# EasyEDA Pro project ProPrj_Piano_scan_for_conserts3_2026-02-26.epro, schematic reuse_sensors
Board Name: reuse_sensors; Create Date: 2025-11-23; Page Name: rs; Project Name: Piano_scan_for_conserts; Schematic Name: reuse_sensors; Update Date: 2025-11-23; Company: EasyEDA.com; Page Size: A4; Version: V1.0
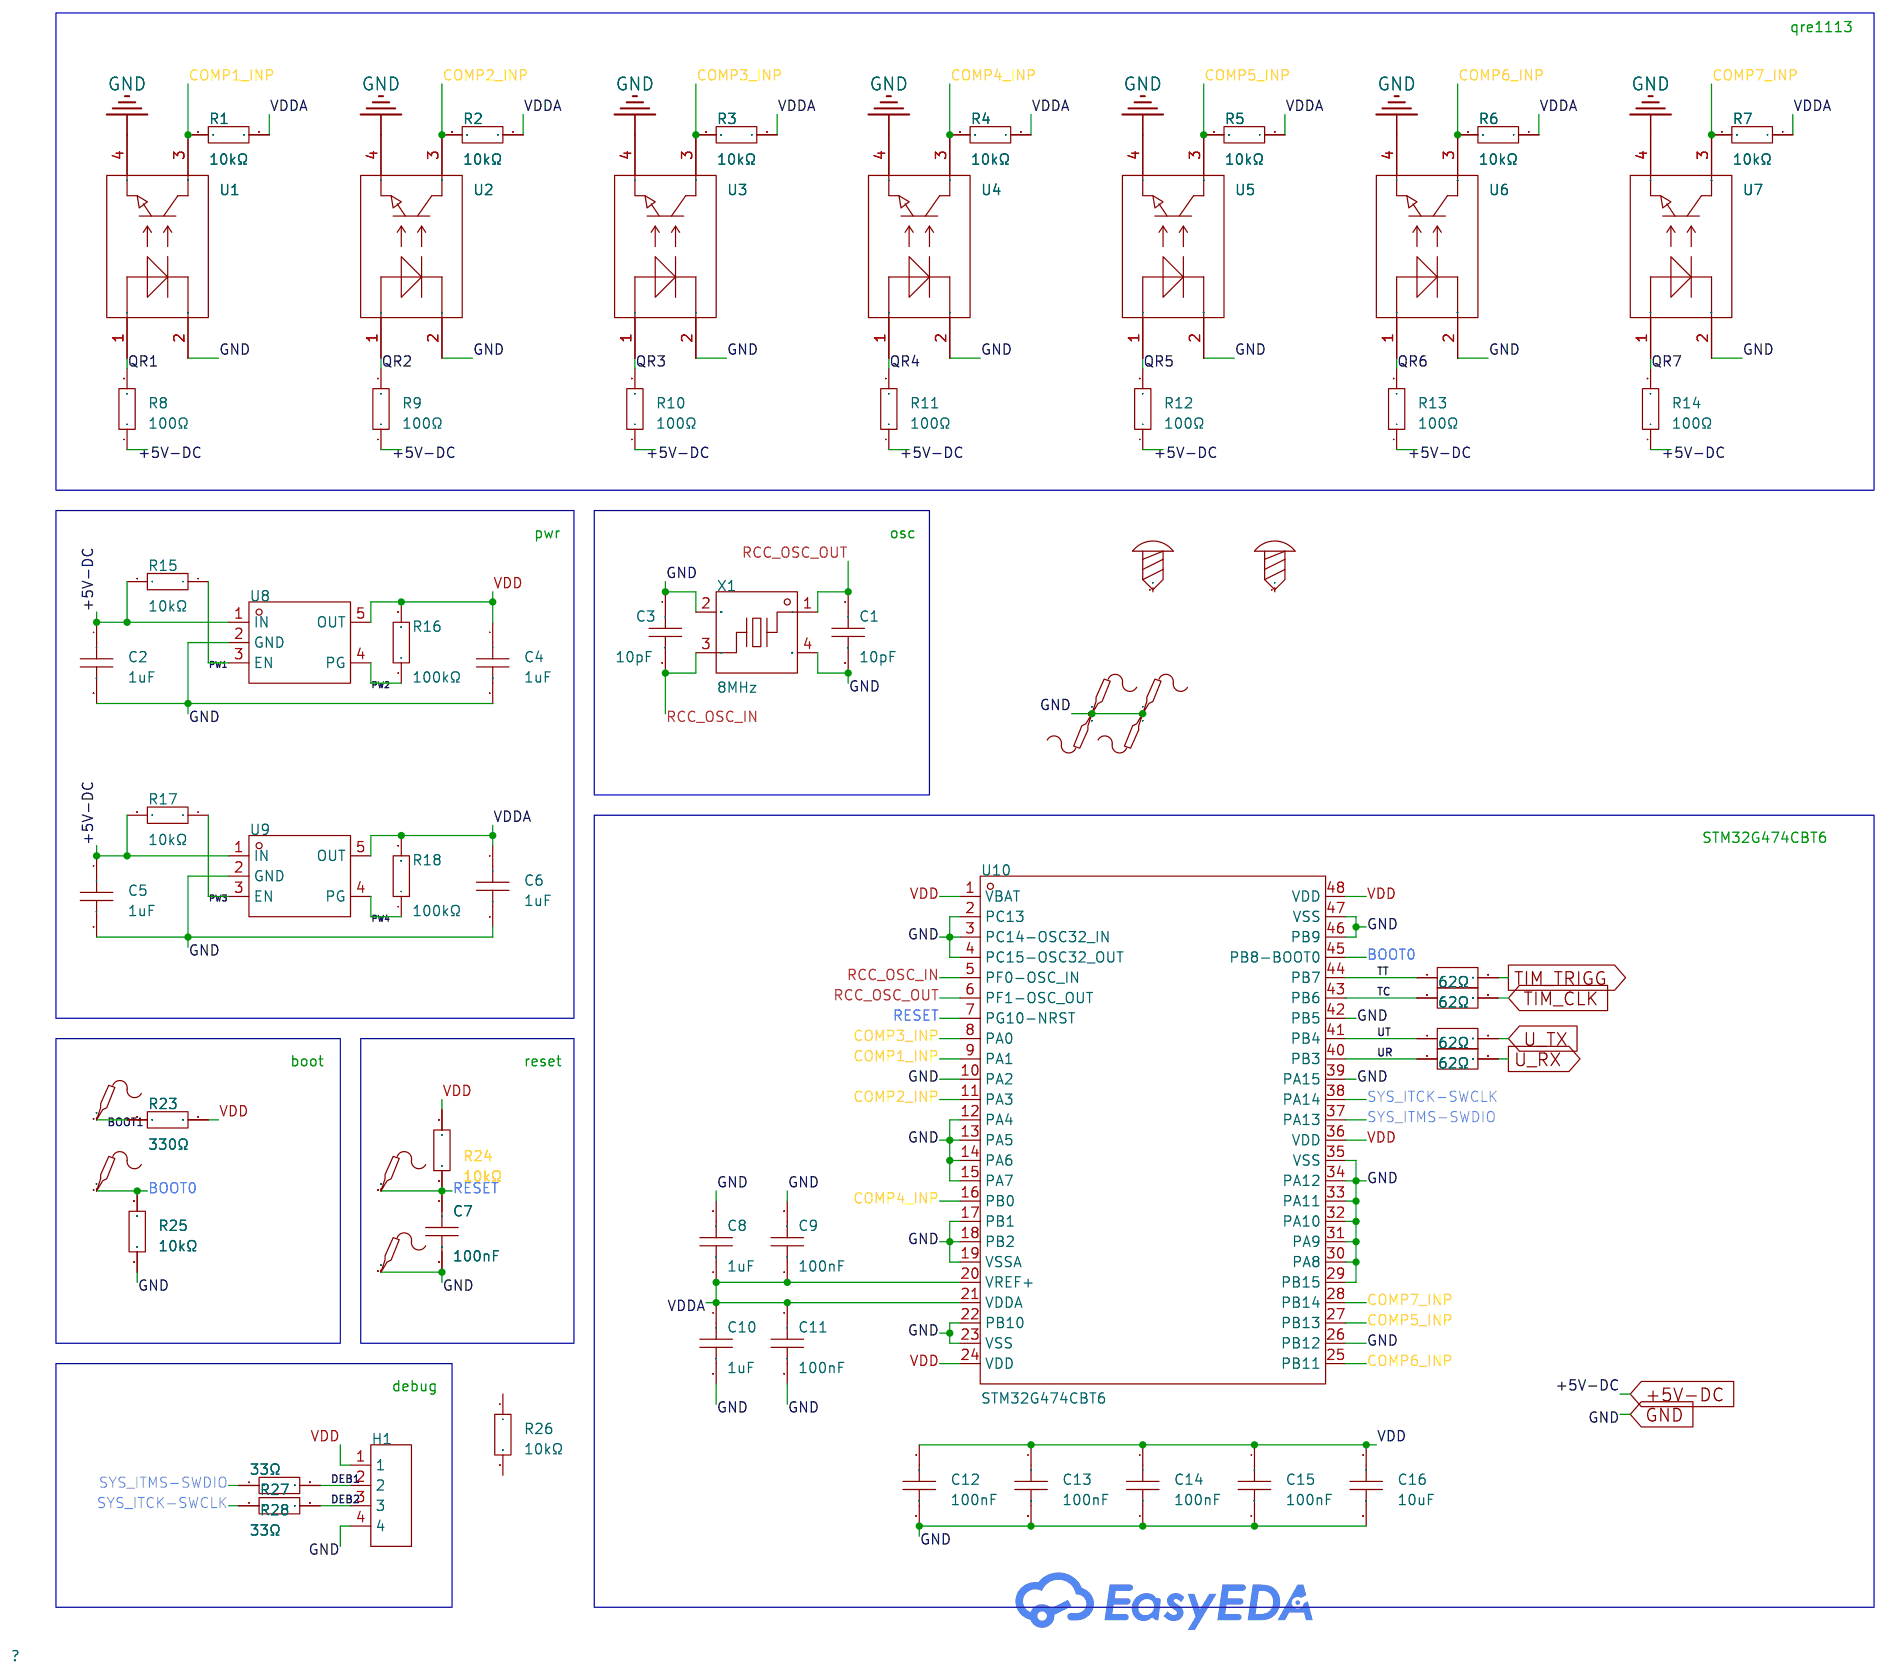
[diagram p3: schematic sheet]

## Parts
BOOT1  -  [Test-Point-0.5mm]  (no BOM)
BOOT2  -  [Test-Point-0.5mm]  (no BOM)
C1  10pF  [C0402]
C2  1uF  [C0402]
C3  10pF  [C0402]
C4  1uF  [C0402]
C5  1uF  [C0402]
C6  1uF  [C0402]
C7  100nF  [C0402]
C8  1uF  [C0402]
C9  100nF  [C0402]
C10  1uF  [C0402]
C11  100nF  [C0402]
C12  100nF  [C0402]
C13  100nF  [C0402]
C14  100nF  [C0402]
C15  100nF  [C0402]
C16  10uF  [C0402]
G1  -  [Test-Point-0.5mm]  (no BOM)
G2  -  [Test-Point-0.5mm]  (no BOM)
G3  -  [Test-Point-0.5mm]  (no BOM)
G4  -  [Test-Point-0.5mm]  (no BOM)
H1  d  [HDR-TH_4P-P2.54-V-M]  (no BOM)
R1  10kΩ  [R0402]
R2  10kΩ  [R0402]
R3  10kΩ  [R0402]
R4  10kΩ  [R0402]
R5  10kΩ  [R0402]
R6  10kΩ  [R0402]
R7  10kΩ  [R0402]
R8  100Ω  [R0603]
R9  100Ω  [R0603]
R10  100Ω  [R0603]
R11  100Ω  [R0603]
R12  100Ω  [R0603]
R13  100Ω  [R0603]
R14  100Ω  [R0603]
R15  10kΩ  [R0402]
R16  100kΩ  [R0402]
R17  10kΩ  [R0402]
R18  100kΩ  [R0402]
R19  62Ω  [R0402]
R20  62Ω  [R0402]
R21  62Ω  [R0402]
R22  62Ω  [R0402]
R23  330Ω  [R0402]
R24  10kΩ  [R0402]
R25  10kΩ  [R0402]
R26  10kΩ  [R0402]  (no BOM)
R27  33Ω  [R0402]
R28  33Ω  [R0402]
RESET1  -  [Test-Point-0.5mm]  (no BOM)
RESSET1  -  [Test-Point-0.5mm]  (no BOM)
SCREW1  -  [Screw-Hole-M2]  (no BOM)
SCREW2  -  [Screw-Hole-M2]  (no BOM)
U1  q  [OPTO-SMD_QRE1113GR]
U2  q  [OPTO-SMD_QRE1113GR]
U3  q  [OPTO-SMD_QRE1113GR]
U4  q  [OPTO-SMD_QRE1113GR]
U5  q  [OPTO-SMD_QRE1113GR]
U6  q  [OPTO-SMD_QRE1113GR]
U7  q  [OPTO-SMD_QRE1113GR]
U8  p1  [TSOT-23-5_L2.9-W1.6-P0.95-LS2.8-BR]
U9  p2  [TSOT-23-5_L2.9-W1.6-P0.95-LS2.8-BR]
U10  STM32G474CBT6  [LQFP-48_L7.0-W7.0-P0.50-LS9.0-BL]
X1  8MHz  [CRYSTAL-SMD_4P-L3.2-W2.5-BL-1]

## Library data of the parts
BOOT1 BOOT2 G1-G4 RESET1 RESSET1 = Test-Point: Test Point 测试点
C1 C3 = CC0402JRNPO9BN100: Capacitance: Tolerance:±5% Tolerance:±5% Voltage Rated: Temperature Coefficient:; LCSC Part Name: 10pF ±5% 50V; Supplier Part: C106199; Manufacturer: YAGEO(国巨); Supplier Footprint: 0402; JLCPCB Part Class: Extended Part; Datasheet: https://atta.szlcsc.com/upload/public/pdf/source/20181008/C309499_21CC21451B82C39E3D92150FD6B30293.pdf; Supplier: LCSC; Tolerance: ±5%
C2 C4-C6 C8 C10 = CL05A105KA5NQNC: Capacitance: Tolerance:±10% Tolerance:±10% Voltage Rated: Temperature Coefficient:; LCSC Part Name: 1uF ±10% 25V; Supplier Part: C52923; Manufacturer: SAMSUNG(三星); Supplier Footprint: 0402; JLCPCB Part Class: Basic Part; Datasheet: https://atta.szlcsc.com/upload/public/pdf/source/20160218/1457707763339.pdf; Supplier: LCSC; Tolerance: ±10%
C7 C9 C11-C15 = CL05B104KO5NNNC: Capacitance: Tolerance:±10% Tolerance:±10% Voltage Rated: Temperature Coefficient:; LCSC Part Name: 100nF ±10% 16V; Supplier Part: C1525; Manufacturer: SAMSUNG(三星); Supplier Footprint: 0402; JLCPCB Part Class: Basic Part; Datasheet: https://atta.szlcsc.com/upload/public/pdf/source/20160218/1457707763339.pdf; Supplier: LCSC; Tolerance: ±10%
C16 = CL05A106MQ5NUNC: Capacitance: Tolerance:±20% Tolerance:±20% Voltage Rated: Temperature Coefficient:; LCSC Part Name: 10uF ±20% 6.3V; Supplier Part: C15525; Manufacturer: SAMSUNG(三星); Supplier Footprint: 0402; JLCPCB Part Class: Basic Part; Datasheet: https://atta.szlcsc.com/upload/public/pdf/source/20220823/2B02EE04F8F211D38A52DCB16EB6BEBA.pdf; Supplier: LCSC; Tolerance: ±20%
H1 = HDR-M_2.54_1x4P: Supplier Footprint: Through
R1-R7 R15 R17 R24-R26 = RC0402FR-0710KL: Type:Thick Film Resistors Resistance: Tolerance:±1% Tolerance:±1% Power(Watts): Overload Voltage (Max): Temperature Coefficient:±100ppm/℃ Temperature Coefficient:±100ppm/℃ Operating Temperature Range:-55℃~+155℃ Operating Temperature Range:-55℃~+155℃; LCSC Part Name: 厚膜电阻 10kΩ ±1% 62.5mW; Supplier Part: C60490; Manufacturer: YAGEO(国巨); Supplier Footprint: 0402; JLCPCB Part Class: Extended Part; Datasheet: https://atta.szlcsc.com/upload/public/pdf/source/20170925/C131467_1506321478108990263.pdf; Supplier: LCSC; Type: Thick Film Resistors; Tolerance: ±1%; Temperature Coefficient: ±100ppm/℃; Operating Temperature Range: -55℃~+155℃
R8-R14 = RC0603FR-07100RL: Type:Thick Film Resistors Resistance: Tolerance:±1% Tolerance:±1% Power(Watts): Overload Voltage (Max): Temperature Coefficient:±100ppm/℃ Temperature Coefficient:±100ppm/℃ Operating Temperature Range:-55℃~+155℃ Operating Temperature Range:-55℃~+155℃; LCSC Part Name: 厚膜电阻 100Ω ±1% 100mW; Supplier Part: C105588; Manufacturer: YAGEO(国巨); Supplier Footprint: 0603; JLCPCB Part Class: Extended Part; Datasheet: https://atta.szlcsc.com/upload/public/pdf/source/20180316/70C0E2BDAE7FCC62C531A5A58D202EE1.pdf; Supplier: LCSC; Type: Thick Film Resistors; Tolerance: ±1%; Temperature Coefficient: ±100ppm/℃; Operating Temperature Range: -55℃~+155℃
R16 R18 = RC0402FR-07100KL: Type:Thick Film Resistors Resistance: Tolerance:±1% Tolerance:±1% Power(Watts): Overload Voltage (Max): Temperature Coefficient:±100ppm/℃ Temperature Coefficient:±100ppm/℃ Operating Temperature Range:-55℃~+155℃ Operating Temperature Range:-55℃~+155℃; LCSC Part Name: 厚膜电阻 100kΩ ±1% 62.5mW; Supplier Part: C60491; Manufacturer: YAGEO(国巨); Supplier Footprint: 0402; JLCPCB Part Class: Extended Part; Datasheet: https://atta.szlcsc.com/upload/public/pdf/source/20180927/C295883_E8D83085EA81BD7DE0B2B681138C15EE.pdf; Supplier: LCSC; Type: Thick Film Resistors; Tolerance: ±1%; Temperature Coefficient: ±100ppm/℃; Operating Temperature Range: -55℃~+155℃
R19-R22 = FRC0402F62R0TS: Type:Thick Film Resistors Resistance: Tolerance:±1% Tolerance:±1% Power(Watts): Voltage-Supply(Max): Temperature Coefficient:±100ppm/℃ Temperature Coefficient:±100ppm/℃ Operating Temperature:-55℃~+155℃ Operating Temperature:-55℃~+155℃; LCSC Part Name: 62Ω ±1% 62.5mW 厚膜电阻; Supplier Part: C2909376; Manufacturer: FOJAN(富捷); Supplier Footprint: 0402; JLCPCB Part Class: Extended Part; Datasheet: https://atta.szlcsc.com/upload/public/pdf/source/20211221/925EC7D7225764EE0046F22065062C87.pdf; Supplier: LCSC; Type: Thick Film Resistors; Tolerance: ±1%; Temperature Coefficient: ±100ppm/℃; Operating Temperature: -55℃~+155℃
R23 = RC0402FR-07330RL: Type:Thick Film Resistors Resistance: Tolerance:±1% Tolerance:±1% Power(Watts): Overload Voltage (Max): Temperature Coefficient:±100ppm/℃ Temperature Coefficient:±100ppm/℃ Operating Temperature Range:-55℃~+155℃ Operating Temperature Range:-55℃~+155℃; LCSC Part Name: 厚膜电阻 330Ω ±1% 62.5mW; Supplier Part: C105875; Manufacturer: YAGEO(国巨); Supplier Footprint: 0402; JLCPCB Part Class: Extended Part; Datasheet: https://atta.szlcsc.com/upload/public/pdf/source/20180821/C275644_0D56F95EFF785E7D9A1FEF436B37DA78.pdf; Supplier: LCSC; Type: Thick Film Resistors; Tolerance: ±1%; Temperature Coefficient: ±100ppm/℃; Operating Temperature Range: -55℃~+155℃
R27 R28 = RC0402FR-0733RL: Type:Thick Film Resistors Resistance: Tolerance:±1% Tolerance:±1% Power(Watts): Overload Voltage (Max): Temperature Coefficient:±100ppm/℃ Temperature Coefficient:±100ppm/℃ Operating Temperature Range:-55℃~+155℃ Operating Temperature Range:-55℃~+155℃; LCSC Part Name: 厚膜电阻 33Ω ±1% 62.5mW; Supplier Part: C138002; Manufacturer: YAGEO(国巨); Supplier Footprint: 0402; JLCPCB Part Class: Extended Part; Datasheet: https://atta.szlcsc.com/upload/public/pdf/source/20181009/C309620_DA5935B6E1D48212CB7A533FE518B3C2.pdf; Supplier: LCSC; Type: Thick Film Resistors; Tolerance: ±1%; Temperature Coefficient: ±100ppm/℃; Operating Temperature Range: -55℃~+155℃
SCREW1 SCREW2 = Screw-Hole-M2: Supplier Footprint: 插件
U1-U7 = QRE1113GR: Sensing Distance:1mm Collector Current (Max):20mA; Supplier Part: C232862; Manufacturer: onsemi(安森美); Supplier Footprint: SMD-4P; JLCPCB Part Class: Extended Part; Datasheet: https://atta.szlcsc.com/upload/public/pdf/source/20221020/4EA8EB874547A092CF9AAECC2DF94CC1.pdf; Supplier: LCSC; Sensing Distance: 1mm; Collector Current (Max): 20mA
U8 U9 = LDLN030G33R: Output Type:Fixed Maximum Input Voltage:5.5V Output Voltage:3.3V Output Voltage:3.3V Output Current:300mA Dropout Voltage:230mV@(300mA) standby current:30uA Feature:Low ESR；Thermal Protection(TSD)；Overcurrent Protection(OCP)；With ability Operating Tempera; LCSC Part Name: 300 mA超低噪声LDO，带供电正常指示和软启动功能; Supplier Part: C2688672; Manufacturer: ST(意法半导体); Supplier Footprint: TSOT-23-5; JLCPCB Part Class: Extended Part; Datasheet: https://atta.szlcsc.com/upload/public/pdf/source/20210324/C2688672_742C24F7CE986B82804365FE2FD46427.pdf; Supplier: LCSC; Output Type: Fixed; Maximum Input Voltage: 5.5V; Output Voltage: 3.3V; Output Current: 300mA; Dropout Voltage: 230mV@(300mA); standby current: 30uA; Feature: Low ESR；Thermal Protection(TSD)；Overcurrent Protection(OCP)；With ability; Operating Temperature: -40℃~+125℃@(Tj); Output Polarity: Positive electrode; Number of Outputs: 1
U10 = STM32G474CBT6: CPU Maximum Speed:170MHz Program Storage Size:128KB Number of I/O:38 ADC (Bit):12bit DAC (Bit):12bit Voltage - Supply:1.71V~3.6V Voltage - Supply:1.71V~3.6V Applications:-; Supplier Part: C730123; Manufacturer: ST(意法半导体); Supplier Footprint: LQFP-48(7x7); JLCPCB Part Class: Extended Part; Datasheet: https://atta.szlcsc.com/upload/public/pdf/source/20200902/C431632_38212262685EE30B1989689374F08940.pdf; Supplier: LCSC; CPU Maximum Speed: 170MHz; Program Storage Size: 128KB; Number of I/O: 38; ADC (Bit): 12bit; DAC (Bit): 12bit; Voltage - Supply: 1.71V~3.6V
X1 = 3225-8.00-10-10-10/A: Crystal Type:Surface Mount Crystal Frequency: Normal temperature Frequency Tolerance:±10ppm Normal temperature Frequency Tolerance:±10ppm Load Capacitance: Operating Temperature:- Operating Temperature:-; LCSC Part Name: 8MHz ±10ppm 10pF; Supplier Part: C518154; Manufacturer: LIMING(利明); Supplier Footprint: SMD3225-4P; JLCPCB Part Class: Extended Part; Datasheet: https://atta.szlcsc.com/upload/public/pdf/source/20200603/C518143_C28693AFC6B5677A46756E3C75F63174.pdf; Supplier: LCSC; Crystal Type: Surface Mount Crystal; Normal temperature Frequency Tolerance: ±10ppm

## Nets
+5V-DC: C2.1 C5.1 R8.1 R9.1 R10.1 R11.1 R12.1 R13.1 R14.1 R15.2 R17.2 U8.1(IN) U9.1(IN)
GND: C1.2 C2.2 C3.1 C4.2 C5.2 C6.2 C7.2 C8.2 C9.2 C10.2 C11.2 C12.2 C13.2 C14.2 C15.2 C16.2 G1.1 G2.1 G3.1 G4.1 H1.4 R25.1 RESET1.1 U1.2 U1.4 U2.2 U2.4 U3.2 U3.4 U4.2 U4.4 U5.2 U5.4 U6.2 U6.4 U7.2 U7.4 U8.2(GND) U9.2(GND) U10.2(PC13) U10.3(PC14-OSC32_IN) U10.4(PC15-OSC32_OUT) U10.10(PA2) U10.12(PA4) U10.13(PA5) U10.14(PA6) U10.15(PA7) U10.17(PB1) U10.18(PB2) U10.19(VSSA) U10.22(PB10) U10.23(VSS) U10.26(PB12) U10.29(PB15) U10.30(PA8) U10.31(PA9) U10.32(PA10) U10.33(PA11) U10.34(PA12) U10.35(VSS) U10.39(PA15) U10.42(PB5) U10.46(PB9) U10.47(VSS) X1.2(GND) X1.4(GND)
VDD: C4.1 C12.1 C13.1 C14.1 C15.1 C16.1 H1.1 R16.2 R23.1 R24.1 U8.5(OUT) U10.1(VBAT) U10.24(VDD) U10.36(VDD) U10.48(VDD)
VDDA: C6.1 C8.1 C9.1 C10.1 C11.1 R1.1 R2.1 R3.1 R4.1 R5.1 R6.1 R7.1 R18.2 U9.5(OUT) U10.20(VREF+) U10.21(VDDA)
BOOT0: BOOT2.1 R25.2 U10.45(PB8-BOOT0)
BOOT1: BOOT1.1 R23.2
COMP1_INP: R1.2 U1.3 U10.9(PA1)
COMP2_INP: R2.2 U2.3 U10.11(PA3)
COMP3_INP: R3.2 U3.3 U10.8(PA0)
COMP4_INP: R4.2 U4.3 U10.16(PB0)
COMP5_INP: R5.2 U5.3 U10.27(PB13)
COMP6_INP: R6.2 U6.3 U10.25(PB11)
COMP7_INP: R7.2 U7.3 U10.28(PB14)
DEB1: H1.2 R27.2
DEB2: H1.3 R28.2
PW1: R15.1 U8.3(EN)
PW2: R16.1 U8.4(PG)
PW3: R17.1 U9.3(EN)
PW4: R18.1 U9.4(PG)
QR1: R8.2 U1.1
QR2: R9.2 U2.1
QR3: R10.2 U3.1
QR4: R11.2 U4.1
QR5: R12.2 U5.1
QR6: R13.2 U6.1
QR7: R14.2 U7.1
RCC_OSC_IN: C3.2 U10.5(PF0-OSC_IN) X1.3
RCC_OSC_OUT: C1.1 U10.6(PF1-OSC_OUT) X1.1
RESET: C7.1 R24.2 RESSET1.1 U10.7(PG10-NRST)
SYS_ITCK-SWCLK: R28.1 U10.38(PA14)
SYS_ITMS-SWDIO: R27.1 U10.37(PA13)
TC: R20.1 U10.43(PB6)
TIM_CLK: R20.2
TIM_TRIGG: R19.2
TT: R19.1 U10.44(PB7)
U_RX: R22.2
U_TX: R21.2
UR: R22.1 U10.40(PB3)
UT: R21.1 U10.41(PB4)

Not connected (* = marked no-connect by the designer): R26 1 2; SCREW1 1; SCREW2 1

## Notes on the sheet
- qre1113
- pwr
- osc
- STM32G474CBT6
- boot
- reset
- debug
